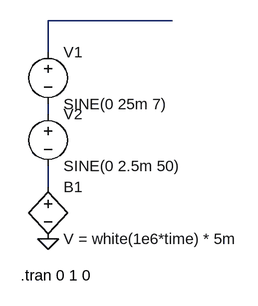
[diagram p0: schematic input signal.asc]
input signal.asc, the LTspice schematic file:
Version 4
SHEET 1 880 680
WIRE 304 64 112 64
WIRE 112 112 112 64
WIRE 112 208 112 192
WIRE 112 320 112 288
FLAG 112 400 0
SYMBOL voltage 112 96 R0
WINDOW 123 0 0 Left 0
WINDOW 39 0 0 Left 0
SYMATTR InstName V1
SYMATTR Value SINE(0 25m 7)
SYMBOL voltage 112 192 R0
WINDOW 123 0 0 Left 0
WINDOW 39 0 0 Left 0
SYMATTR InstName V2
SYMATTR Value SINE(0 2.5m 50)
SYMBOL bv 112 304 R0
SYMATTR InstName B1
SYMATTR Value V = white(1e6*time) * 5m
TEXT 70 456 Left 2 !.tran 0 1 0

The netlist it stands for:
* input signal.asc
V1 N001 N002 SINE(0 25m 7)
V2 N002 N003 SINE(0 2.5m 50)
B1 N003 0 V = white(1e6*time) * 5m
.tran 0 1 0
.backanno
.end